# Altium schematic sheet 12 - JETSON_CON.SchDoc: JETSON-CON
size A3; Page Number: 12; Page Size: B; Page Count: 12; Board Rev: B; RevCode: 1.0; Doc: 305-PD-19-0819; DsnPath: C:\Users\HAltinkilit\Downloads\Crosslink-NX-Design-Files\CrossLink-NX-Eval-Brd-Schematic-RevB-191122.DSN; SchematicName: SCHEMATIC1; PageName: 08 - PMOD; PageSize: B; TopSchematic: True
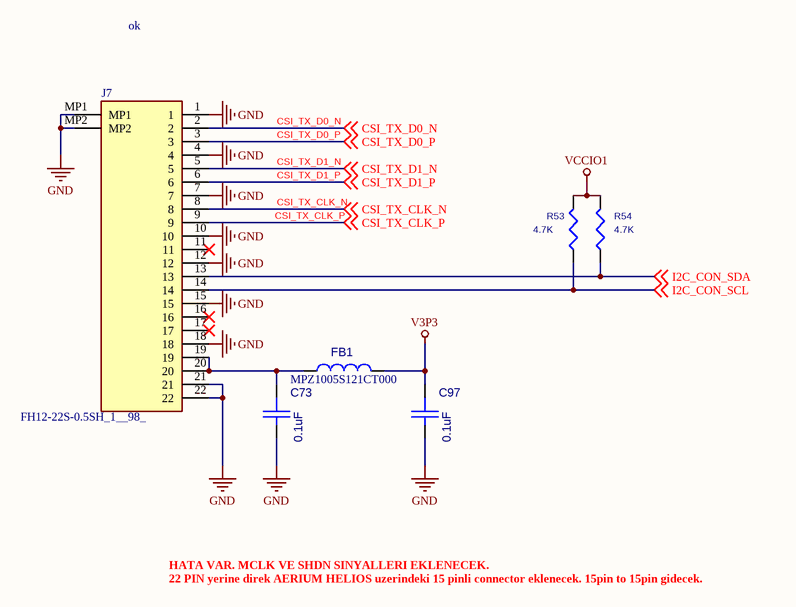
[diagram p0: 12 - JETSON_CON.SchDoc]

## Parts
C73  0.1uF  [C0201]
C97  0.1uF  [C0201]
FB1  MPZ1005S121CT000  [FB0402]
J7  FH12-22S-0.5SH_1__98_  [FH1222S05SH198]
R53  4.7K  [r0402]
R54  4.7K  [r0402]

## Nets
GND: C73.2 C97.2 J7.1 J7.4 J7.7 J7.10 J7.12 J7.15 J7.18 J7.21 J7.22 J7.MP1 J7.MP2
V3P3: C97.1 FB1.1
VCCIO1: R53.2 R54.2
CSI_TX_CLK_N: J7.8 ; off-sheet CSI_TX_CLK_N
CSI_TX_CLK_P: J7.9 ; off-sheet CSI_TX_CLK_P
CSI_TX_D0_N: J7.2 ; off-sheet CSI_TX_D0_N
CSI_TX_D0_P: J7.3 ; off-sheet CSI_TX_D0_P
CSI_TX_D1_N: J7.5 ; off-sheet CSI_TX_D1_N
CSI_TX_D1_P: J7.6 ; off-sheet CSI_TX_D1_P
I2C_CON_SCL: J7.14 R53.1 ; off-sheet I2C_CON_SCL
I2C_CON_SDA: J7.13 R54.1 ; off-sheet I2C_CON_SDA
NetC73_1: C73.1 FB1.2 J7.19 J7.20

Not connected (* = marked no-connect by the designer): J7 11* 16* 17*

## Notes on the sheet
- ok
- HATA VAR. MCLK VE SHDN SINYALLERI EKLENECEK.
- 22 PIN yerine direk AERIUM HELIOS uzerindeki 15 pinli connector eklenecek. 15pin to 15pin gidecek.
- Proje/Project:
- Sayfa Adı/Document Name:
- Çizilme Tarihi/Drawing Date
- Umit KAYACIK
- Tasarlayan/Designed By
- Sayfa/Sheet:
- Revision:
- of
- Son Güncelleme/Last Edit Date
- Kontrol eden/Checked By
- Onaylayan/Approved By
- Boyut/Size:
- Varyant/Variant:
- Dil/Language:
- A3
- ENG

## Library data of the parts
C73 C97 = CAP_1: CAP CER 0.1UF 25V 10% X5R 0201; Part Reference: C113; Manufacturer: Murata; Manufacturer Part Number: GRM033R61E104KE14J; Value: 0.1uF; Assy: -; PCB Footprint: C0201
FB1 = INDUCTOR_1: FERRITE BEAD 120 OHM 0402 1LN; Part Reference: FB4; Manufacturer: TDK Corporation; Value: MPZ1005S121CT000; Assy: -; PCB Footprint: FB0402; Manufacturer Part Number: MPZ1005S121CT000
J7 = FH12-22S-0.5SH_1__98_: Connector; Manufacturer_Name: Hirose; Manufacturer_Part_Number: FH12-22S-0.5SH(1)(98); Datasheet Link: https://www.hirose.com/en/product/document?clcode=CL0528-0014-1-98&productname=FH12-22S-0.5SH(1)(98)&series=FH12&documenttype=2DDrawing&lang=en&documentid=0001188303; Height: 2.2mm; Mouser Part Number: 798-FH1222S05SH198; Mouser Price/Stock: https://www.mouser.co.uk/ProductDetail/Hirose-Connector/FH12-22S-0.5SH198?qs=tTj%252BmQ3KZwZO1A%252B5eseZow%3D%3D
R53 = RESISTOR: Part Reference: R18; Populate: <Populate>; PCB Footprint: RLP-101; Value: 4.7K; ASSY: -
R54 = RESISTOR: Part Reference: R19; Populate: <Populate>; PCB Footprint: RLP-101; Value: 4.7K; ASSY: -